# EAGLE design SparkFun_Window_Comparator (EAGLE 7.2.0)
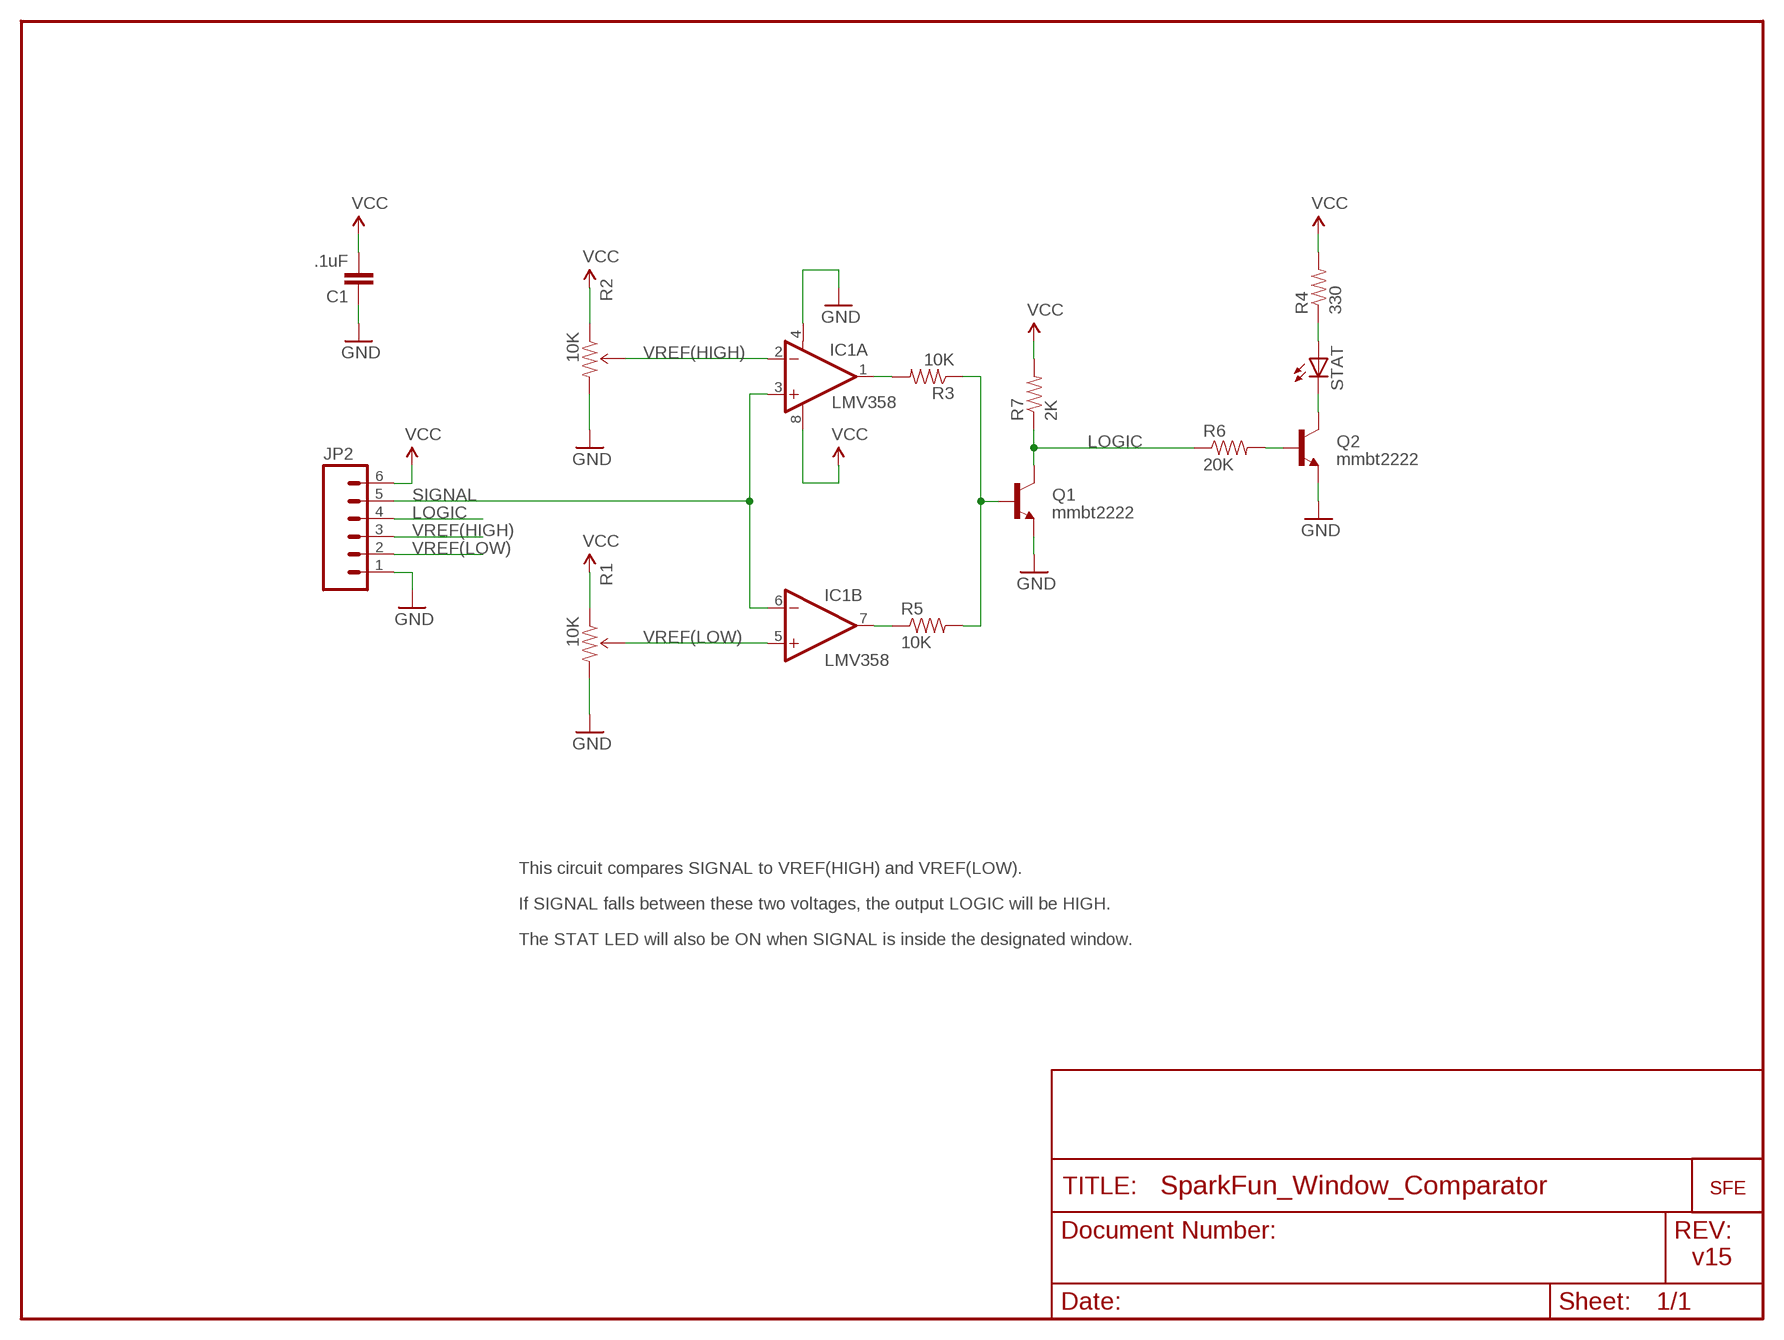
[diagram p0: schematic, sheet 1]

## Parts
C1  .1uF  CAP0603-CAP  [0603-CAP]
IC1  LMV358  OPAMP-DUALU  [SO08]
JP2  M06SIP  [1X06]
Q1  mmbt2222  TRANSISTOR_NPNSOT23-3  [SOT23-3]
Q2  mmbt2222  TRANSISTOR_NPNSOT23-3  [SOT23-3]
R1  10K  TRIMPOTSMD  [TRIMPOT-3MM]
R2  10K  TRIMPOTSMD  [TRIMPOT-3MM]
R3  10K  RESISTOR0603-RES  [0603-RES]
R4  330  RESISTOR0603-RES  [0603-RES]
R5  10K  RESISTOR0603-RES  [0603-RES]
R6  20K  RESISTOR0603-RES  [0603-RES]
R7  2K  RESISTOR0603-RES  [0603-RES]
STAT  LED0603  [LED-0603]
U$3  LOGO-SFENEW  [SFE-NEW-WEBLOGO]

## Nets
GND: C1.1 IC1.4(A:V-) JP2.1 Q1.2(E) Q2.2(E) R1.3(CW) R2.3(CW)
LOGIC: JP2.4 Q1.3(C) R6.1 R7.1
N$1: Q1.1(B) R3.1 R5.2
N$2: R4.1 STAT.A
N$3: Q2.1(B) R6.2
N$4: Q2.3(C) STAT.C
N$5: IC1.1(A:OUT) R3.2
N$6: IC1.7(B:OUT) R5.1
SIGNAL: IC1.3(A:+IN) IC1.6(B:-IN) JP2.5
VCC: C1.2 IC1.8(A:V+) JP2.6 R1.1(CCW) R2.1(CCW) R4.2 R7.2
VREF(HIGH): IC1.2(A:-IN) JP2.3 R2.2(WIPER)
VREF(LOW): IC1.5(B:+IN) JP2.2 R1.2(WIPER)

## Notes on the sheet
- This circuit compares SIGNAL to VREF(HIGH) and VREF(LOW).
- If SIGNAL falls between these two voltages, the output LOGIC will be HIGH.
- The STAT LED will also be ON when SIGNAL is inside the designated window.
- v15

## Library data of the parts
C1 = SparkFun:CAP: Capacitor Standard 0603 ceramic capacitor, and 0.1" leaded capacitor.
IC1 = SparkFun:OPAMP-DUAL: Operational Amplifier
JP2 = SparkFun:M06: Header 6 Standard 6-pin 0.1" header. Use with straight break away headers (SKU : PRT-00116), right angle break away headers (PRT-00553), swiss pins (PRT-00743), machine pins (PRT-00117), and female headers (PRT-00115). Molex polarized connector foot print use with SKU : PRT-08094 with associated crimp pins and housings. NOTES ON THE VARIANTS LOCK and LOCK_LONGPADS... This footprint was designed to help hold the alignment of a through-hole component (i.e. 6-pin header) while soldering it into place. You may notice that each hole has been shifted either up or down by 0.005 of an inch from it's more standard position (which is a perfectly straight line). This slight alteration caused the pins (the squares in the middle) to touch the edges of the holes. Because they are alternating, it causes a "brace" to hold the component in place. 0.005 has proven to be the perfect amount of "off-center" position when using our standard breakaway headers. Although looks a little odd when you look at the bare footprint, once you have a header in there, the alteration is very hard to notice. Also, if you push a header all the way into place, it is covered up entirely on the bottom side. This idea of altering the position of holes to aid alignment will be further integrated into the Sparkfun Library for other footprints. It can help hold any component with 3 or more connection pins.
Q1 Q2 = SparkFun:TRANSISTOR_NPN: Transistor NPN BJT configuration in SOT23 package. MMBT2222 is the common NPN we use. Double check BCE configuration again layout.
R1 R2 = SparkFun:TRIMPOT
R3-R7 = SparkFun:RESISTOR: Resistor Basic schematic elements and footprints for 0603, 1206, and PTH resistors.
STAT = SparkFun:LED: LEDs Standard schematic elements and footprints for 5mm, 3mm, 1206, and 0603 sized LEDs. 5mm - Spark Fun Electronics SKU : COM-00529 (and others)
U$3 = SparkFun:LOGO-SFE: Spark Fun Electronics PCB Logo This is the standard Spark Fun Electronics PCB logo.

## Board
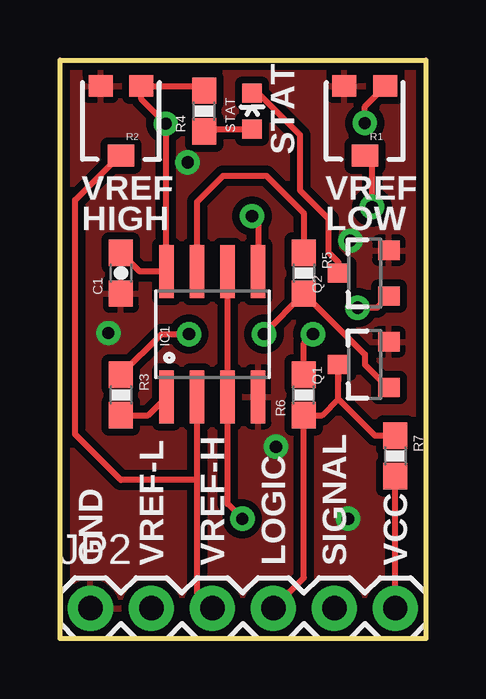
[diagram p1: board, top side]
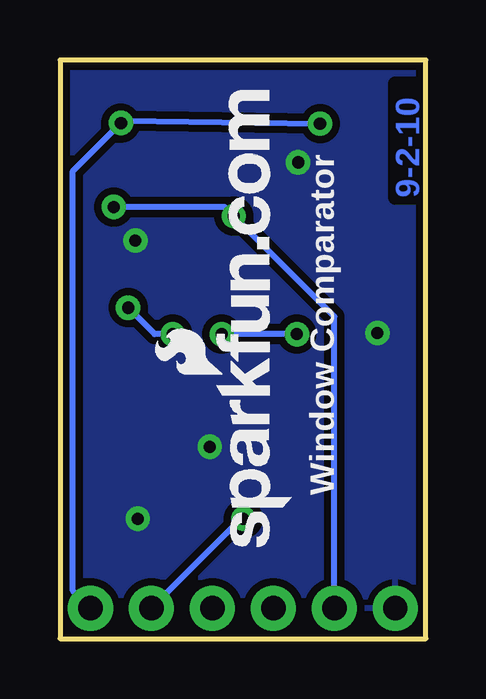
[diagram p2: board, bottom side, seen from below]

Size 15.24 x 24.13 mm. Coordinates in mm from the lower left corner, seen from the top.
Outline: 0,0 0,24.13 15.24,24.13 15.24,0 0,0
Copper layers (1*16): Top 0.035mm / dielectric 1.5mm / Bottom 0.035mm
Design rules "SparkFun": minimum track width 8mil, minimum drill 20mil, track to track 8mil, track to pad 8mil, pad to pad 8mil, via to via 8mil, smd to smd 8mil, copper to edge 10mil, drill to drill 8mil, minimum pad ring 12mil, minimum via ring 10mil, stop-mask expansion 4mil, vias tented up to drill 25mil, thermal gap 10mil

### Footprints (pad centres in the part's own frame; a part is rotated, then mirrored left to right if it is on the bottom)
0603-CAP = smd 1.1 x 1: 1 -0.85,0; 2 0.85,0
SO08 = smd 0.61 x 2.21: 1 -1.905,-2.616; 2 -0.635,-2.616; 3 0.635,-2.616; 4 1.905,-2.616; 5 1.905,2.616; 6 0.635,2.616; 7 -0.635,2.616; 8 -1.905,2.616
1X06 = drill 1.016 pad 1.88 round: 1 0,0; 2 2.54,0; 3 5.08,0; 4 7.62,0; 5 10.16,0; 6 12.7,0
SOT23-3 = smd 0.8 x 0.9: 1 -0.95,-1; 2 0.95,-1; 3 0,1.1
TRIMPOT-3MM = smd 1 x 0.9: 1 -0.85,-1.45; 3 0.85,-1.45 | smd 1.1 x 0.9: 2 0,1.45
0603-RES = smd 1.1 x 1: 1 -0.85,0; 2 0.85,0
LED-0603 = smd 0.8 x 0.8: A 0,-0.75; C 0,0.75

### Placement (x,y rotation side)
C1  2.54,15.24 90 top
IC1  6.35,12.7 0 top
JP2  1.27,1.27 0 top
Q1  12.7,11.43 90 top
Q2  12.7,15.24 90 top
R1  12.7,21.59 180 top
R2  2.54,21.59 180 top
R3  2.54,10.16 270 top
R4  6,22 90 top
R5  10.16,15.24 270 top
R6  10.16,10.16 90 top
R7  13.97,7.62 270 top
STAT  8,22 0 top
U$3  5.59,3.83 90 bottom

### Tracks (layer width: path | path; a pad name or v marks a point on that pad's centre or on a via)
GND  (via drill 0.51)
  other vias: 2.02,12.75 9,8 12.1,16.6 12,5 5.32,19.86
  pour Top (isolate 0.305): 0,0 0,24.13 15.24,24.13 15.24,0
  pour Bottom (isolate 0.305): 0,0 0,24.13 15.24,24.13 15.24,0
LOGIC
  Top 0.254: R7.1 13.12,8.47 11.6,9.99 | JP2.4 10.16,2.54 R6.1 10.92,9.31 11.6,9.99 | 11.6,10.75 Q1.3 11.6,9.99
N$1  (via drill 0.51)
  Top 0.254: Q1.1 13.65,10.48 12.7,11.43 12.7,11.85 R5.2 8.5,12.73 v8.5,12.7 | R3.1 4.23,12.7 v5.37,12.7
  Bottom 0.254: v5.37,12.7 v8.5,12.7
N$2
  Top 0.254: R4.1 6.35,21.07 6.53,21.25 STAT.A
N$3  (via drill 0.51)
  Top 0.254: Q2.1 13.21,13.8 v12.4,13.8 | R6.2 10.16,12.32 v10.54,12.7
  Bottom 0.254: v12.4,13.8 11.3,12.7 v10.54,12.7
N$4
  Top 0.254: STAT.C 8.25,22.75 10,21 10,18.69 11.2,17.49 11.2,16.1 11.6,15.7 Q2.3
N$5
  Top 0.254: R3.2 3.67,9.31 IC1.1
N$6
  Top 0.254: R5.1 10.16,17.74 8.6,19.3 6.8,19.3 5.71,18.21 IC1.7
SIGNAL  (via drill 0.51)
  Top 0.254: IC1.6 IC1.3 6.99,5.62 v7.6,5
  Bottom 0.254: JP2.5 7.7,5 v7.6,5
VCC  (via drill 0.51)
  Top 0.254: 6.35,22.48 R4.2 5.75,23.04 R2.1 3.39,22.49 v4.41,21.47 4.41,15.36 IC1.8 3.31,15.32 C1.2 2.54,16.29 | v12.7,21.5 12.7,22.19 R1.1 | JP2.6 R7.2
  Bottom 0.254: v4.41,21.47 12.6,21.6 v12.7,21.5 14.7,19.5 14.7,2 JP2.6
VREF(HIGH)
  Top 0.254: 5.71,6.62 5.71,1.91 JP2.3 | 5.71,6.62 IC1.2 | 5.71,6.62 2.54,6.62 0.64,8.52 0.64,18.29 2.49,20.14 R2.2
VREF(LOW)  (via drill 0.51)
  Top 0.254: R1.2 13,19.84 v13,18 | IC1.5 8.26,17.36 v8,17.62
  Bottom 0.254: v13,18 8.38,18 v8,17.62 3.81,13.43 JP2.2

### Text on the board
Bottom: 9-2-10
tPlace: STAT | VREF | VREF | HIGH | LOW | GND | VREF-L | VREF-H | LOGIC | SIGNAL | VCC
bPlace: Window Comparator
tValues: 100K trimpot | LMV358